# Altium schematic sheet DigitalClock.SchDoc
size A3; SheetNumber: 1; SheetTotal: 1
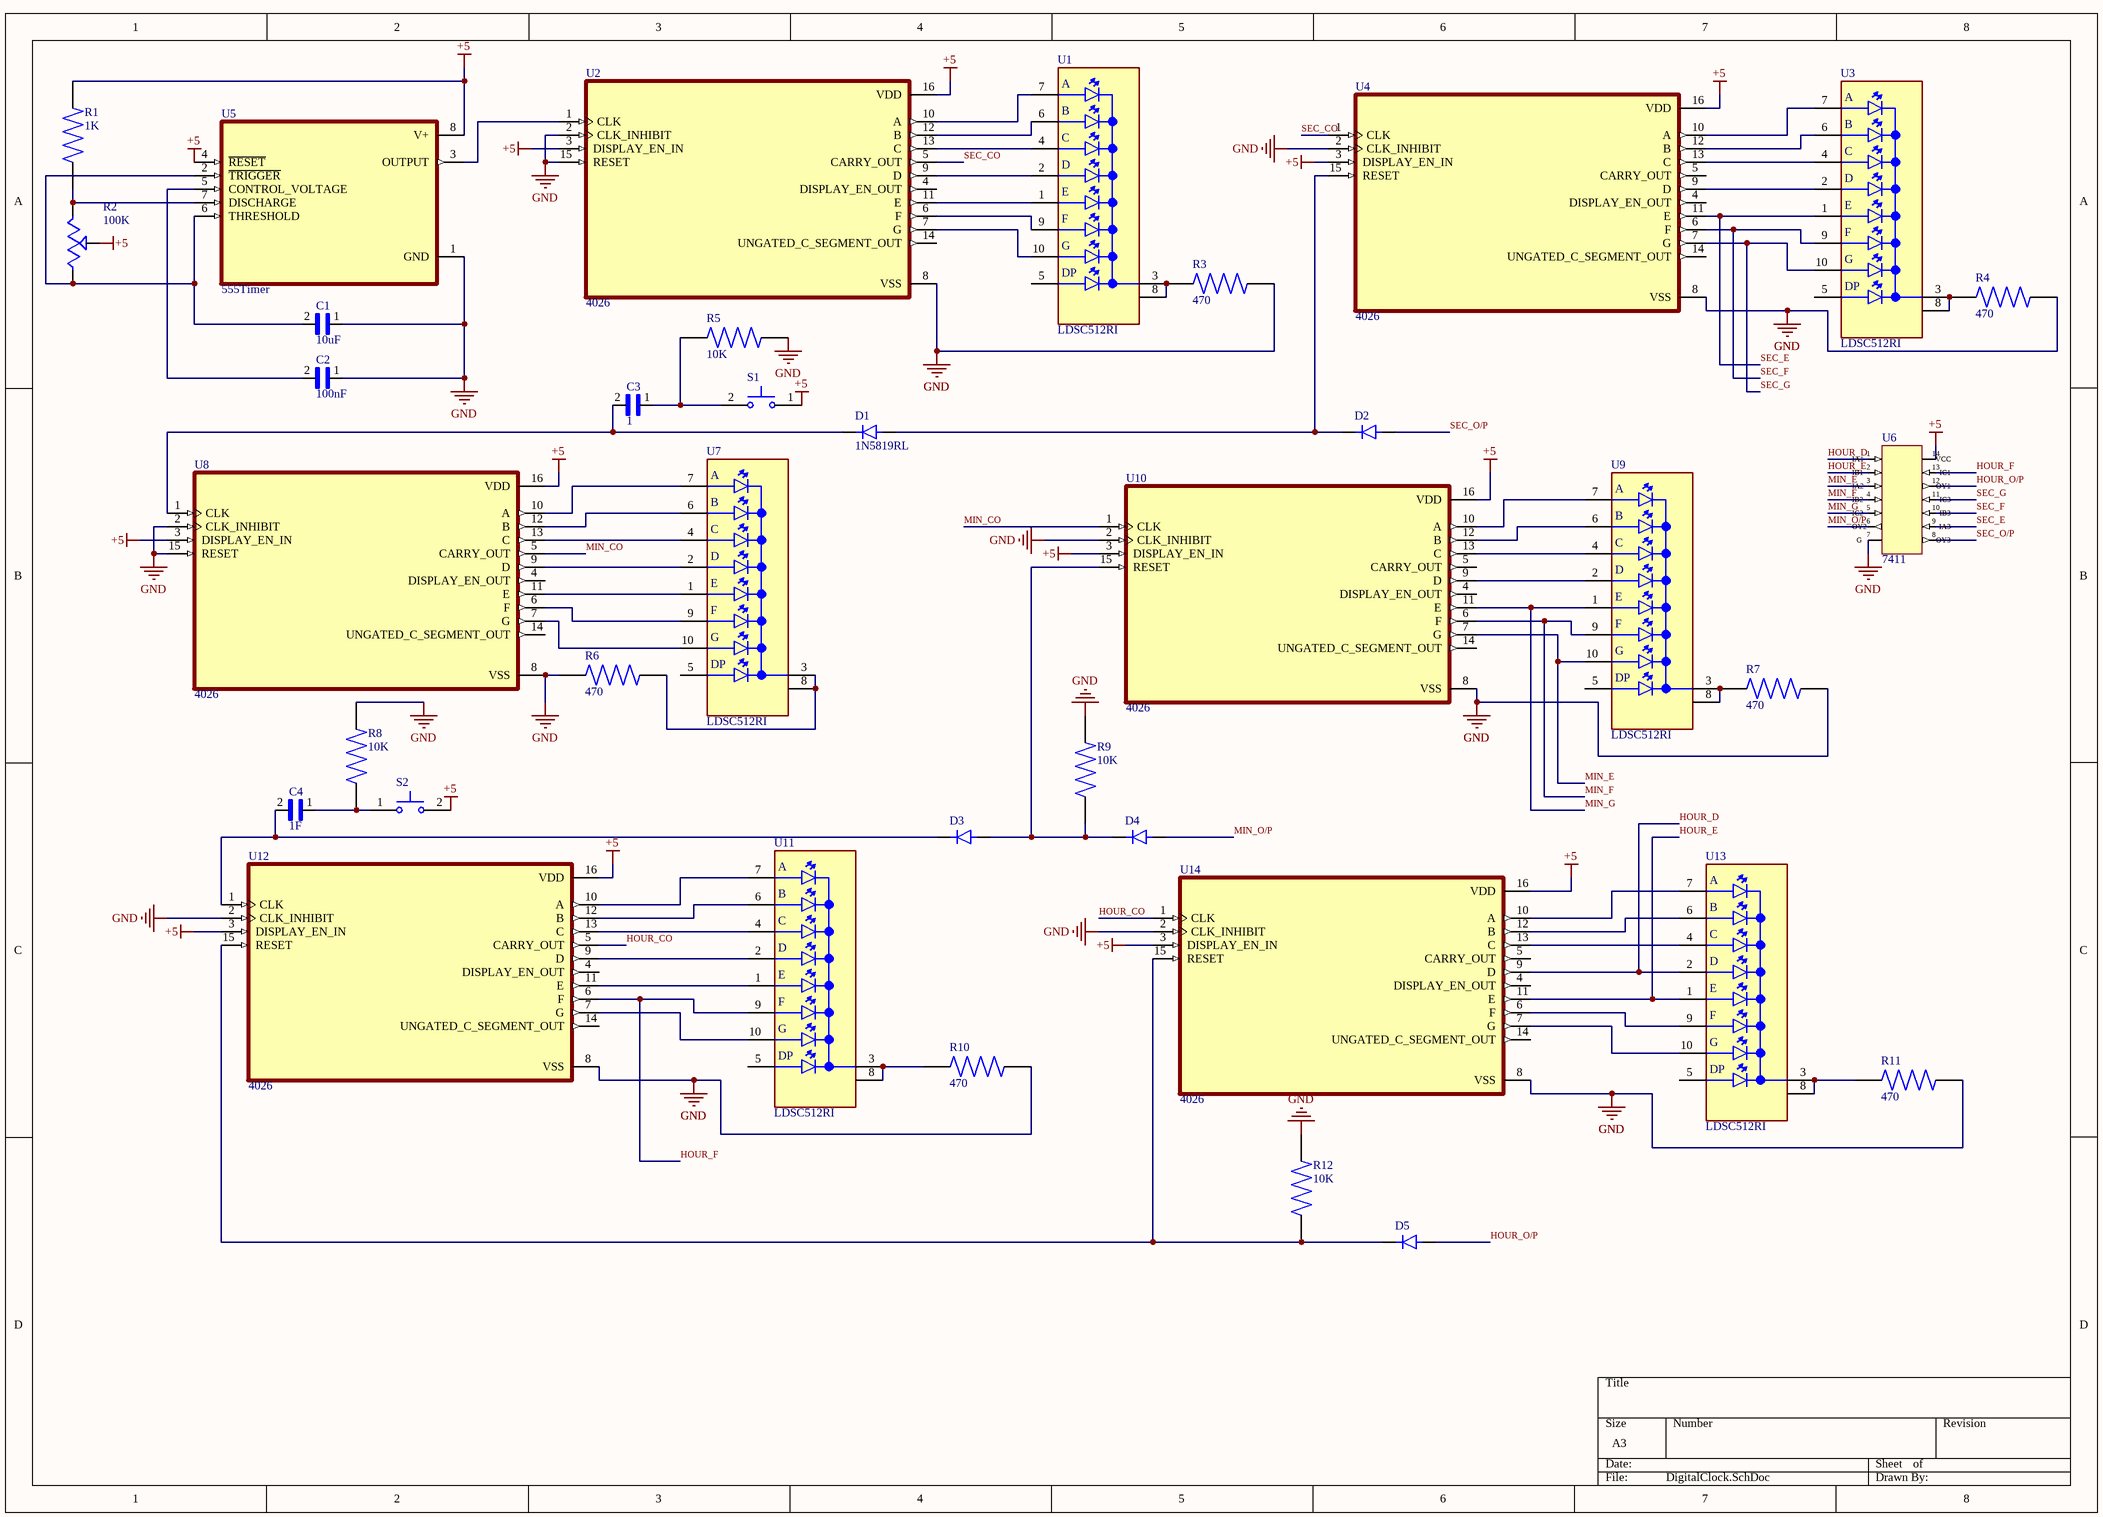
[diagram p0: DigitalClock.SchDoc]

## Parts
C1  10uF  [CAPC1005X55N]
C2  100nF  [CAPC1005X55N]
C3  1  [CAPC1005X55N]
C4  1F  [CAPC1005X55N]
D1  1N5819RL  [DIOAD1036W78L470D235]
D2  1N5819RL  [DIOAD1036W78L470D235]  (value not drawn)
D3  1N5819RL  [DIOAD1036W78L470D235]  (value not drawn)
D4  1N5819RL  [DIOAD1036W78L470D235]  (value not drawn)
D5  1N5819RL  [DIOAD1036W78L470D235]  (value not drawn)
R1  1K  [RESAD1100W55L680D260]
R2  100K  [POT_RD901F-40-15R1-B100K-00DL1]
R3  470  [TO508P1060X500X1900-2]
R4  470  [RES_ERJU01J683C]
R5  10K  [RES_ERJU01J683C]
R6  470  [RES_ERJU01J683C]
R7  470  [RES_ERJU01J683C]
R8  10K  [RES_ERJU01J683C]
R9  10K  [RES_ERJU01J683C]
R10  470  [RES_ERJU01J683C]
R11  470  [RES_ERJU01J683C]
R12  10K  [RES_ERJU01J683C]
S1  BUTT-2  [SW_BUTT-2]  (value not drawn)
S2  BUTT-2  [SW_BUTT-2]  (value not drawn)
U1  LDSC512RI  [LED_LDSC512RI]
U2  4026  [DIP794W45P254L1969H508Q16]
U3  LDSC512RI  [LED_LDSC512RI]
U4  4026  [DIP794W45P254L1969H508Q16]
U5  555Timer  [SOIC127P599X175-8N]
U6  7411  [IC 7411]
U7  LDSC512RI  [LED_LDSC512RI]
U8  4026  [DIP794W45P254L1969H508Q16]
U9  LDSC512RI  [LED_LDSC512RI]
U10  4026  [DIP794W45P254L1969H508Q16]
U11  LDSC512RI  [LED_LDSC512RI]
U12  4026  [DIP794W45P254L1969H508Q16]
U13  LDSC512RI  [LED_LDSC512RI]
U14  4026  [DIP794W45P254L1969H508Q16]

## Nets
+5: R1.2 R2.2 S1.1 S2.2 U2.3(DISPLAY_EN_IN) U2.16(VDD) U4.3(DISPLAY_EN_IN) U4.16(VDD) U5.4(~{RESET}) U5.8(V+) U6.14(VCC) U8.3(DISPLAY_EN_IN) U8.16(VDD) U10.3(DISPLAY_EN_IN) U10.16(VDD) U12.3(DISPLAY_EN_IN) U12.16(VDD) U14.3(DISPLAY_EN_IN) U14.16(VDD)
GND: C1.1 C2.1 R3.2 R4.2 R5.1 R6.2 R7.2 R8.2 R9.2 R10.2 R11.2 R12.2 U2.2(CLK_INHIBIT) U2.8(VSS) U2.15(RESET) U4.2(CLK_INHIBIT) U4.8(VSS) U5.1(GND) U6.7(G) U8.2(CLK_INHIBIT) U8.8(VSS) U8.15(RESET) U10.2(CLK_INHIBIT) U10.8(VSS) U12.2(CLK_INHIBIT) U12.8(VSS) U14.2(CLK_INHIBIT) U14.8(VSS)
HOUR_CO: U12.5(CARRY_OUT) U14.1(CLK)
HOUR_D: U6.1(IA1) U13.2(D) U14.9(D)
HOUR_E: U6.2(IB1) U13.1(E) U14.11(E)
HOUR_F: U6.13(IC1) U11.9(F) U12.6(F)
HOUR_O/P: D5.A U6.12(OY1)
MIN_CO: U8.5(CARRY_OUT) U10.1(CLK)
MIN_E: U6.3(IA2) U9.10(G) U10.7(G)
MIN_F: U6.4(IB2) U9.9(F) U10.6(F)
MIN_G: U6.5(IC2) U9.1(E) U10.11(E)
MIN_O/P: D4.A U6.6(OY2)
SEC_CO: U2.5(CARRY_OUT) U4.1(CLK)
SEC_E: U3.1(E) U4.11(E) U6.9(IA3)
SEC_F: U3.9(F) U4.6(F) U6.10(IB3)
SEC_G: U3.10(G) U4.7(G) U6.11(IC3)
SEC_O/P: D2.A U6.8(OY3)
NetC1_2: C1.2 R2.1 U5.2(~{TRIGGER}) U5.6(THRESHOLD)
NetC2_2: C2.2 U5.5(CONTROL_VOLTAGE)
NetC3_1: C3.1 R5.2 S1.2
NetC3_2: C3.2 D1.C(K) U8.1(CLK)
NetC4_1: C4.1 R8.1 S2.1
NetC4_2: C4.2 D3.C(K) U12.1(CLK)
NetD1_A: D1.A D2.C(K) U4.15(RESET)
NetD3_A: D3.A D4.C(K) R9.1 U10.15(RESET)
NetD5_C: D5.C(K) R12.1 U12.15(RESET) U14.15(RESET)
NetR1_1: R1.1 R2.3 U5.7(DISCHARGE)
NetR3_1: R3.1 U1.3(CC) U1.8(CC)
NetR4_1: R4.1 U3.3(CC) U3.8(CC)
NetR6_1: R6.1 U7.3(CC) U7.8(CC)
NetR7_1: R7.1 U9.3(CC) U9.8(CC)
NetR10_1: R10.1 U11.3(CC) U11.8(CC)
NetR11_1: R11.1 U13.3(CC) U13.8(CC)
NetU1_1: U1.1(E) U2.11(E)
NetU1_2: U1.2(D) U2.9(D)
NetU1_4: U1.4(C) U2.13(C)
NetU1_6: U1.6(B) U2.12(B)
NetU1_7: U1.7(A) U2.10(A)
NetU1_9: U1.9(F) U2.6(F)
NetU1_10: U1.10(G) U2.7(G)
NetU2_1: U2.1(CLK) U5.3(OUTPUT)
NetU3_2: U3.2(D) U4.9(D)
NetU3_4: U3.4(C) U4.13(C)
NetU3_6: U3.6(B) U4.12(B)
NetU3_7: U3.7(A) U4.10(A)
NetU7_1: U7.1(E) U8.11(E)
NetU7_2: U7.2(D) U8.9(D)
NetU7_4: U7.4(C) U8.13(C)
NetU7_6: U7.6(B) U8.12(B)
NetU7_7: U7.7(A) U8.10(A)
NetU7_9: U7.9(F) U8.6(F)
NetU7_10: U7.10(G) U8.7(G)
NetU9_2: U9.2(D) U10.9(D)
NetU9_4: U9.4(C) U10.13(C)
NetU9_6: U9.6(B) U10.12(B)
NetU9_7: U9.7(A) U10.10(A)
NetU11_1: U11.1(E) U12.11(E)
NetU11_2: U11.2(D) U12.9(D)
NetU11_4: U11.4(C) U12.13(C)
NetU11_6: U11.6(B) U12.12(B)
NetU11_7: U11.7(A) U12.10(A)
NetU11_10: U11.10(G) U12.7(G)
NetU13_4: U13.4(C) U14.13(C)
NetU13_6: U13.6(B) U14.12(B)
NetU13_7: U13.7(A) U14.10(A)
NetU13_9: U13.9(F) U14.6(F)
NetU13_10: U13.10(G) U14.7(G)

Not connected (* = marked no-connect by the designer): U1 5(DP); U2 4(DISPLAY_EN_OUT) 14(UNGATED_C_SEGMENT_OUT); U3 5(DP); U4 4(DISPLAY_EN_OUT) 5(CARRY_OUT) 14(UNGATED_C_SEGMENT_OUT); U7 5(DP); U8 4(DISPLAY_EN_OUT) 14(UNGATED_C_SEGMENT_OUT); U9 5(DP); U10 4(DISPLAY_EN_OUT) 5(CARRY_OUT) 14(UNGATED_C_SEGMENT_OUT); U11 5(DP); U12 4(DISPLAY_EN_OUT) 14(UNGATED_C_SEGMENT_OUT); U13 5(DP); U14 4(DISPLAY_EN_OUT) 5(CARRY_OUT) 14(UNGATED_C_SEGMENT_OUT)

## Library data of the parts
C1-C4 = C0402H102J5GACTU: CAPACITOR, NP0, 0402, 50V, 1NF; Capacitance:1000pF; Capacitance Tolerance:Â± 5%; Dielectric Characteristic:C0G / NP0; Voltage Rating:50V; Capacitor Case Style:0402; Operating Temperature Range:-55Â°C to +200Â°C; SVHC:No SVHC (19-Dec-2011); Capacitor Mounting:SMD; Package: None; Price: None; Value: *; MP: C0402H102J5GACTU; Availability: Unavailable
D1-D5 = 1N5819RL: Diode Schottky 40 V 1A Through Hole Axial; MF: ON Semiconductor; MP: 1N5819RL; Value: *; Check_prices: https://www.snapeda.com/parts/1N5819RL/Onsemi/view-part/?ref=eda; Package: DO-41-2 ON Semiconductor; Price: None; Availability: In Stock; SnapEDA_Link: https://www.snapeda.com/parts/1N5819RL/Onsemi/view-part/?ref=snap
R1 R3-R12 = ERJU01J683C: Package: None; Price: None; Value: *; Availability: Unavailable; MP: ERJU01J683C
R2 = RD901F-40-15R1-B100K-00DL1: Potentiometers 9mm Linear 100K Round Shaft; MF: Alpha (Taiwan); SnapEDA_Link: https://www.snapeda.com/parts/RD901F-40-15R1-B100K-00DL1/Alpha+Taiwan/view-part/?ref=snap; Package: None; Value: *; MP: RD901F-40-15R1-B100K-00DL1; Check_prices: https://www.snapeda.com/parts/RD901F-40-15R1-B100K-00DL1/Alpha+Taiwan/view-part/?ref=eda
S1 S2 = BUTT-2: Tactile Switches MINI PUSH BUTTON SWITCH 2-PIN QTY. 4; MF: Gravitech; Purchase-URL: https://pricing.snapeda.com/search/part/BUTT-2/?ref=eda; Package: None; Value: *; Check_prices: https://www.snapeda.com/parts/BUTT-2/Gravitech/view-part/?ref=eda; SnapEDA_Link: https://www.snapeda.com/parts/BUTT-2/Gravitech/view-part/?ref=snap; Availability: In Stock; Price: None; MP: BUTT-2
U1 U3 U7 U9 U11 U13 = LDSC512RI: DISPLAY, 7 SEGMENT, 14.2MM, GREEN; LED Colour:Green; Forward Current If:10mA; Forward Voltage:2.2V; Luminous Intensity:3.5mcd; No. of Digits / Alpha:1; Character Size:14.2mm; Common Connection:Common Cathode; Product Range:-; SVHC:No SVHC (27-Jun-2018); MF: Lumex Optoelectronics; SnapEDA_Link: https://www.snapeda.com/parts/LDSC512RI/Lumex/view-part/?ref=snap; Package: DIP-10 Lumex; Value: *; MP: LDSC512RI; Check_prices: https://www.snapeda.com/parts/LDSC512RI/Lumex/view-part/?ref=eda
U2 U4 U8 U10 U12 U14 = CD4026BE: CMOS Decade Counter/Divider with Decoded 7-Segment Display Outputs and Display Enable 16-PDIP -55 to 125; MF: Texas Instruments; DigiKey-Purchase-URL: https://snapeda.com/shop?store=DigiKey&id=779031; Package: PDIP-16 Texas Instruments; Mouser-Purchase-URL: https://snapeda.com/shop?store=Mouser&id=779031; Price: None; Availability: Good; Texas_Instruments-Purchase-URL: https://snapeda.com/shop?store=Texas+Instruments&id=779031; MP: CD4026BE; SnapEDA_Link: https://www.snapeda.com/parts/CD4026BE/Texas%20Instruments/view-part/779031/?ref=snap; Value: *
U5 = LMC555CM/NOPB: Worlds smallest 555 timer with low power, high accuracy and a Fmax of 3MHz 8-SOIC -40 to 85; MF: Texas Instruments; SnapEDA_Link: https://www.snapeda.com/parts/LMC555CM/NOPB/Texas%20Instruments/view-part/7189/?ref=snap; Availability: Unavailable; Package: SOIC-8 Texas Instruments; Price: None; MP: LMC555CM/NOPB; Value: *; Texas_Instruments-Purchase-URL: https://snapeda.com/shop?store=Texas+Instruments&id=7189; BuyPart: https://www.snapeda.com/parts/LMC555CM/NOPB/Texas%20Instruments/view-part/7189/?ref=eda
U6 = 7411: Three Input AND Gate